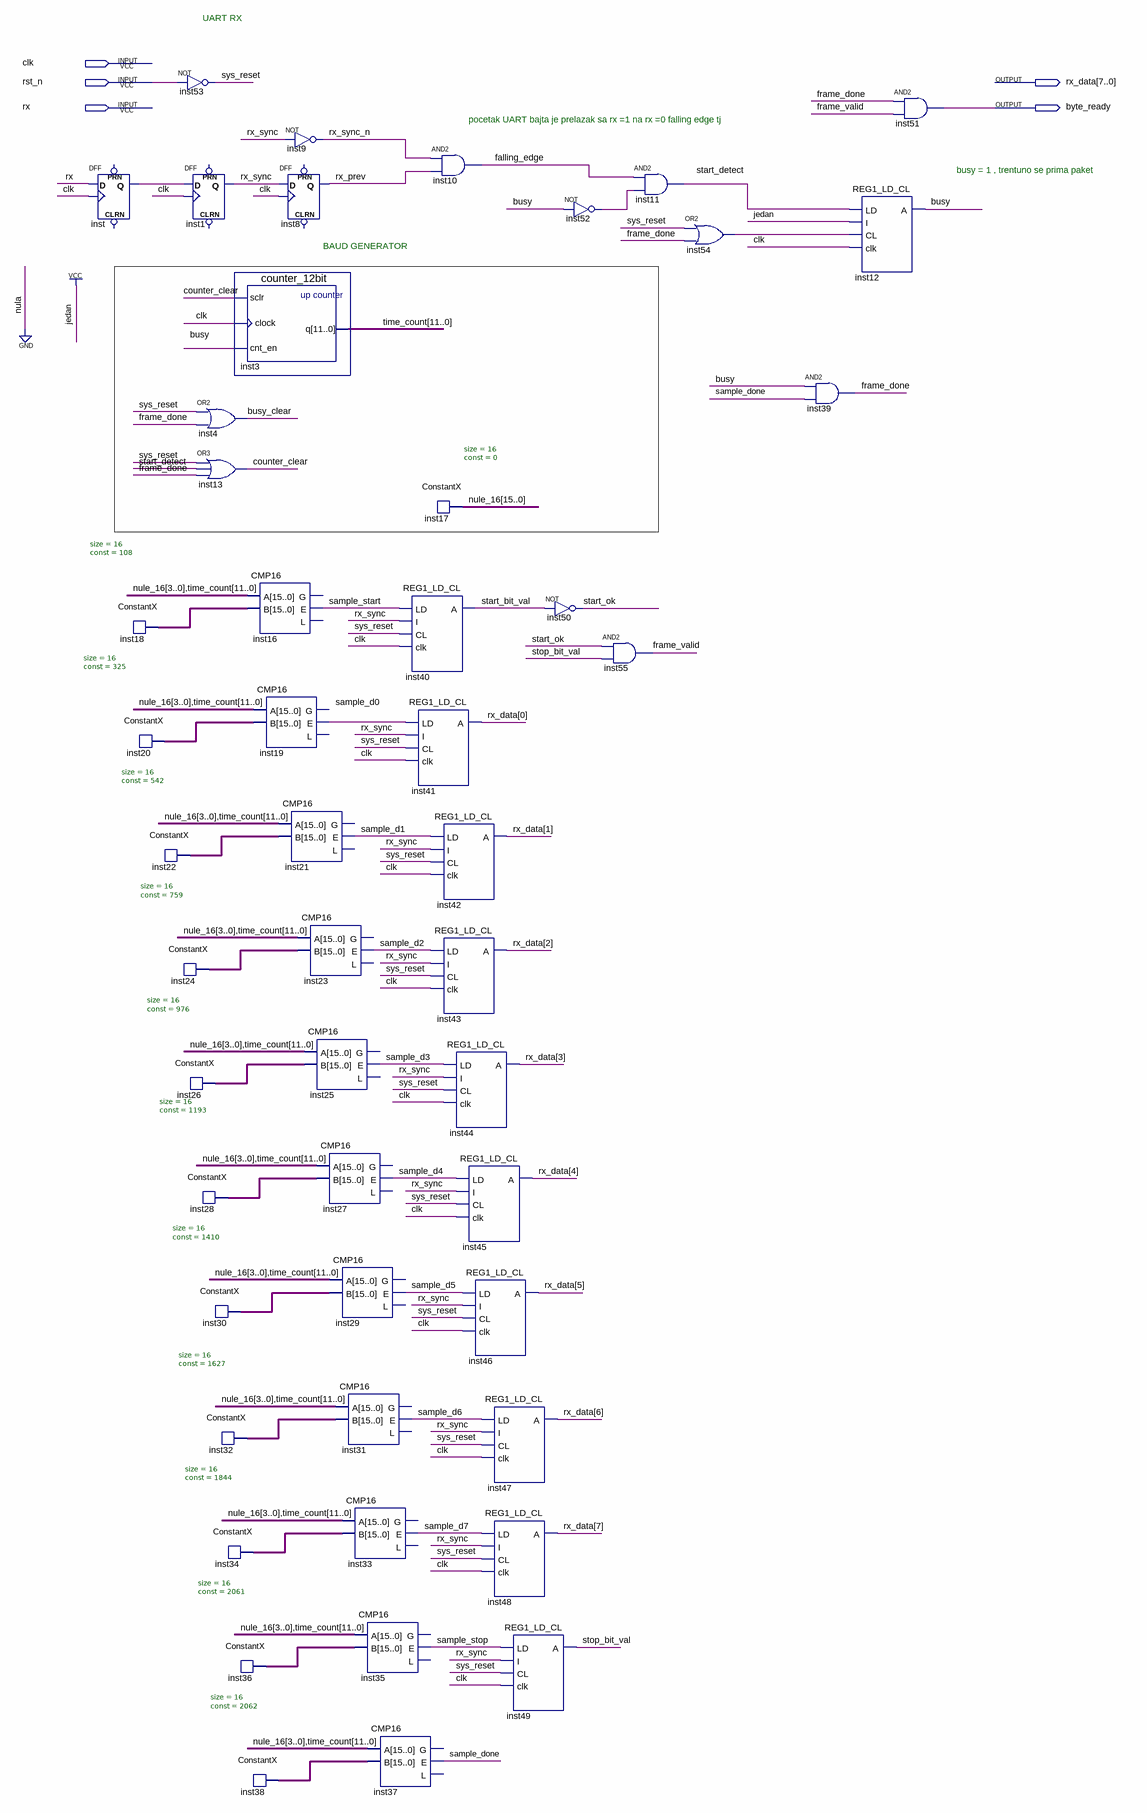
[diagram p0: schematic sheet]
// Quartus schematic UART_RX.bdf as structural Verilog: 50 symbols, 5 pins
module UART_RX (
  input  clk,
  input  rst_n,
  input  rx,
  output [7:0] rx_data,
  output byte_ready
);

  wire busy, busy_clear, counter_clear, falling_edge, frame_done, frame_valid, inst52_out, inst54_out,
       inst_q, rx_prev, rx_sync, rx_sync_n, sample_d0, sample_d1, sample_d2, sample_d3, sample_d4, sample_d5,
       sample_d6, sample_d7, sample_done, sample_start, sample_stop, start_bit_val, start_detect, start_ok,
       stop_bit_val, sys_reset;
  wire [11:0] time_count;
  wire [15:0] inst18_data_out, inst20_data_out, inst22_data_out, inst24_data_out, inst26_data_out,
       inst28_data_out, inst30_data_out, inst32_data_out, inst34_data_out, inst36_data_out, inst38_data_out,
       nule_16;

  DFF inst (.CLK(clk), .D(rx), .Q(inst_q));  // open: CLRN, PRN
  ConstantX #(.size(16), .\const (108)) inst18 (.DATA_OUT(inst18_data_out));
  ConstantX #(.size(16), .\const (325)) inst20 (.DATA_OUT(inst20_data_out));
  ConstantX #(.size(16), .\const (542)) inst22 (.DATA_OUT(inst22_data_out));
  ConstantX #(.size(16), .\const (759)) inst24 (.DATA_OUT(inst24_data_out));
  ConstantX #(.size(16), .\const (976)) inst26 (.DATA_OUT(inst26_data_out));
  not inst53 (sys_reset, rst_n);
  DFF inst1 (.CLK(clk), .D(inst_q), .Q(rx_sync));  // open: CLRN, PRN
  or inst4 (busy_clear, sys_reset, frame_done);
  or inst13 (counter_clear, sys_reset, start_detect, frame_done);
  ConstantX #(.size(16), .\const (1193)) inst28 (.DATA_OUT(inst28_data_out));
  ConstantX #(.size(16), .\const (1410)) inst30 (.DATA_OUT(inst30_data_out));
  ConstantX #(.size(16), .\const (1627)) inst32 (.DATA_OUT(inst32_data_out));
  ConstantX #(.size(16), .\const (1844)) inst34 (.DATA_OUT(inst34_data_out));
  ConstantX #(.size(16), .\const (2061)) inst36 (.DATA_OUT(inst36_data_out));
  counter_12bit inst3 (.sclr(counter_clear), .clock(clk), .cnt_en(busy), .q(time_count));
  CMP16 inst16 (.A({nule_16[3:0], time_count}), .B(inst18_data_out), .E(sample_start));  // open: G, L
  CMP16 inst19 (.A({nule_16[3:0], time_count}), .B(inst20_data_out), .E(sample_d0));  // open: G, L
  ConstantX #(.size(16), .\const (2062)) inst38 (.DATA_OUT(inst38_data_out));
  not inst9 (rx_sync_n, rx_sync);
  DFF inst8 (.CLK(clk), .D(rx_sync), .Q(rx_prev));  // open: CLRN, PRN
  CMP16 inst21 (.A({nule_16[3:0], time_count}), .B(inst22_data_out), .E(sample_d1));  // open: G, L
  CMP16 inst23 (.A({nule_16[3:0], time_count}), .B(inst24_data_out), .E(sample_d2));  // open: G, L
  CMP16 inst25 (.A({nule_16[3:0], time_count}), .B(inst26_data_out), .E(sample_d3));  // open: G, L
  CMP16 inst27 (.A({nule_16[3:0], time_count}), .B(inst28_data_out), .E(sample_d4));  // open: G, L
  CMP16 inst29 (.A({nule_16[3:0], time_count}), .B(inst30_data_out), .E(sample_d5));  // open: G, L
  CMP16 inst31 (.A({nule_16[3:0], time_count}), .B(inst32_data_out), .E(sample_d6));  // open: G, L
  CMP16 inst33 (.A({nule_16[3:0], time_count}), .B(inst34_data_out), .E(sample_d7));  // open: G, L
  CMP16 inst35 (.A({nule_16[3:0], time_count}), .B(inst36_data_out), .E(sample_stop));  // open: G, L
  CMP16 inst37 (.A({nule_16[3:0], time_count}), .B(inst38_data_out), .E(sample_done));  // open: G, L
  ConstantX #(.size(16), .\const (0)) inst17 (.DATA_OUT(nule_16));
  REG1_LD_CL inst40 (.LD(sample_start), .I(rx_sync), .CL(sys_reset), .clk(clk), .A(start_bit_val));
  REG1_LD_CL inst41 (.LD(sample_d0), .I(rx_sync), .CL(sys_reset), .clk(clk), .A(rx_data[0]));
  and inst10 (falling_edge, rx_sync_n, rx_prev);
  REG1_LD_CL inst42 (.LD(sample_d1), .I(rx_sync), .CL(sys_reset), .clk(clk), .A(rx_data[1]));
  REG1_LD_CL inst43 (.LD(sample_d2), .I(rx_sync), .CL(sys_reset), .clk(clk), .A(rx_data[2]));
  REG1_LD_CL inst44 (.LD(sample_d3), .I(rx_sync), .CL(sys_reset), .clk(clk), .A(rx_data[3]));
  REG1_LD_CL inst45 (.LD(sample_d4), .I(rx_sync), .CL(sys_reset), .clk(clk), .A(rx_data[4]));
  REG1_LD_CL inst46 (.LD(sample_d5), .I(rx_sync), .CL(sys_reset), .clk(clk), .A(rx_data[5]));
  REG1_LD_CL inst47 (.LD(sample_d6), .I(rx_sync), .CL(sys_reset), .clk(clk), .A(rx_data[6]));
  REG1_LD_CL inst48 (.LD(sample_d7), .I(rx_sync), .CL(sys_reset), .clk(clk), .A(rx_data[7]));
  REG1_LD_CL inst49 (.LD(sample_stop), .I(rx_sync), .CL(sys_reset), .clk(clk), .A(stop_bit_val));
  not inst52 (inst52_out, busy);
  not inst50 (start_ok, start_bit_val);
  and inst55 (frame_valid, start_ok, stop_bit_val);
  and inst11 (start_detect, falling_edge, inst52_out);
  or inst54 (inst54_out, sys_reset, frame_done);
  and inst39 (frame_done, busy, sample_done);
  REG1_LD_CL inst12 (.LD(start_detect), .I(1'b1), .CL(inst54_out), .clk(clk), .A(busy));
  and inst51 (byte_ready, frame_done, frame_valid);

  // Notes on the sheet:
  //   UART RX
  //   pocetak UART bajta je prelazak sa rx =1 na rx =0 falling edge tj
  //   busy = 1 , trentuno se prima paket
  //   BAUD GENERATOR
endmodule
